# EAGLE design LEDs - Schematic (EAGLE 6.5.0)
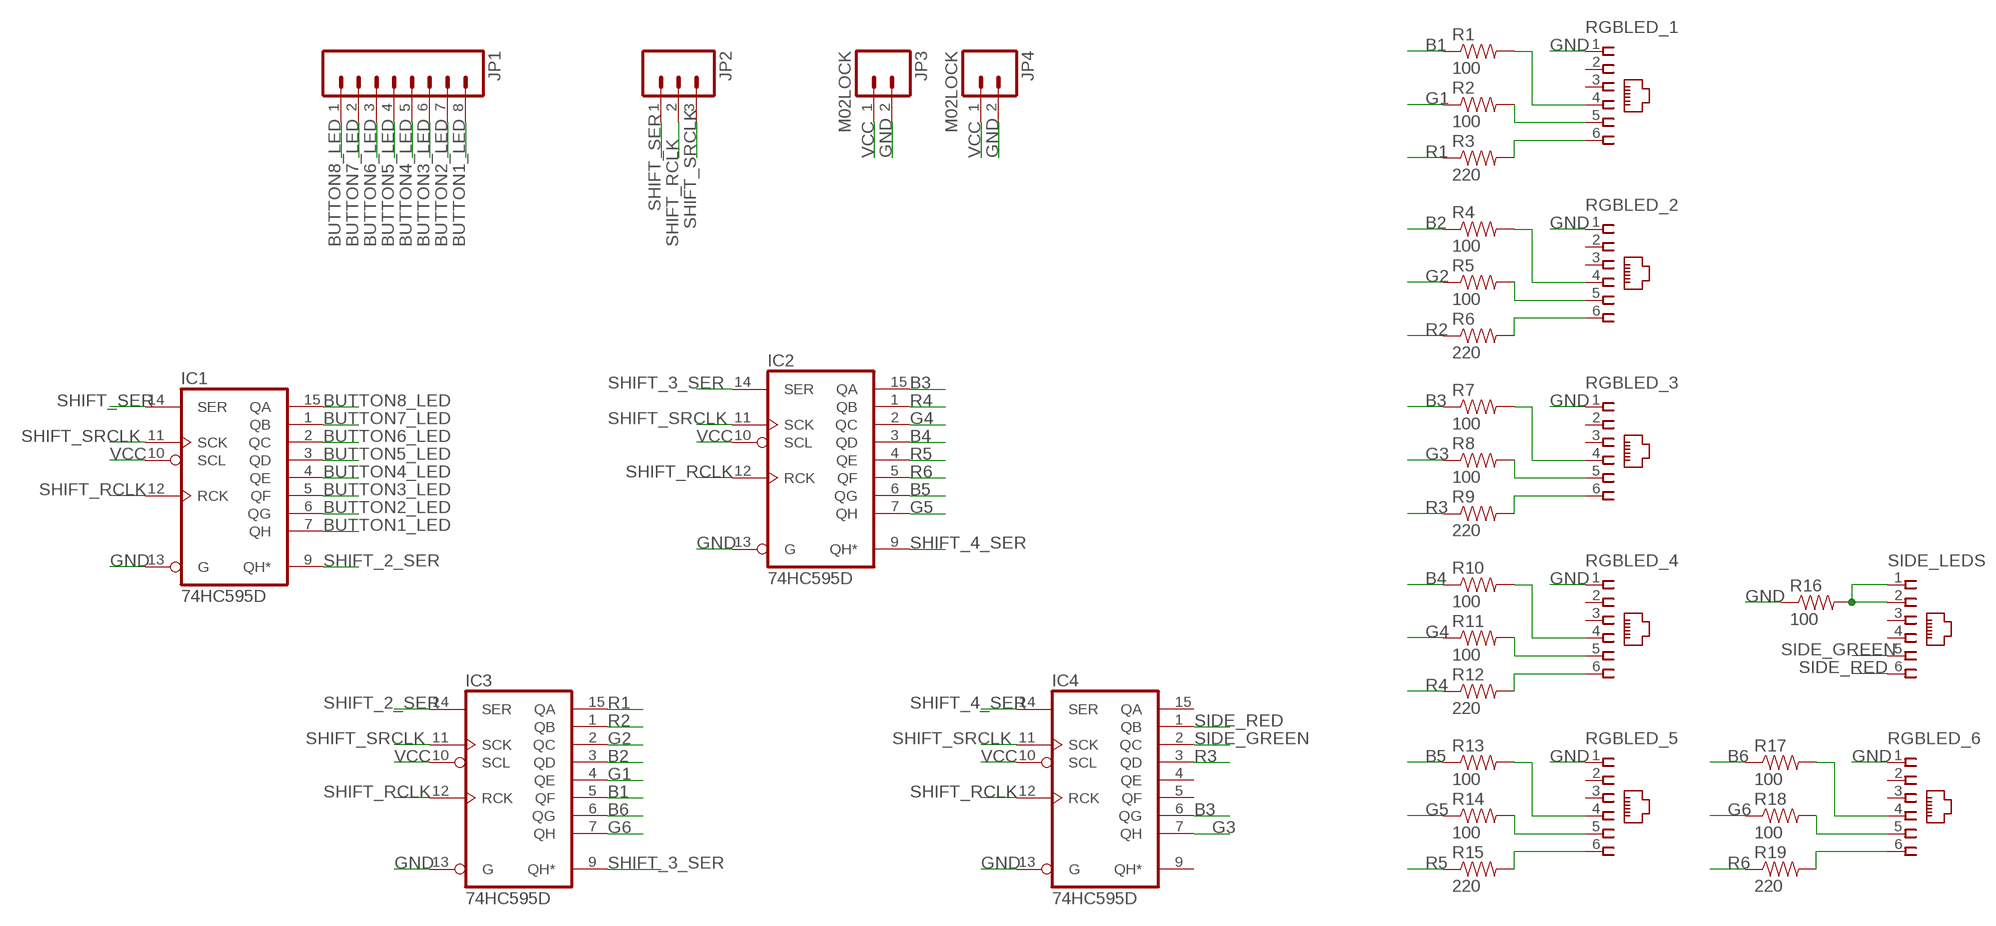
[diagram p0: schematic, sheet 1]

## Parts
IC1  74HC595D  [SO16]
IC2  74HC595D  [SO16]
IC3  74HC595D  [SO16]
IC4  74HC595D  [SO16]
JP1  M08LOCK  [1X08_LOCK]
JP2  M03LOCK  [1X03_LOCK]
JP3  M02LOCK  [1X02_LOCK]
JP4  M02LOCK  [1X02_LOCK]
R1  100  RESISTOR0603  [0603-RES]
R2  100  RESISTOR0603  [0603-RES]
R3  220  RESISTOR0603  [0603-RES]
R4  100  RESISTOR0603  [0603-RES]
R5  100  RESISTOR0603  [0603-RES]
R6  220  RESISTOR0603  [0603-RES]
R7  100  RESISTOR0603  [0603-RES]
R8  100  RESISTOR0603  [0603-RES]
R9  220  RESISTOR0603  [0603-RES]
R10  100  RESISTOR0603  [0603-RES]
R11  100  RESISTOR0603  [0603-RES]
R12  220  RESISTOR0603  [0603-RES]
R13  100  RESISTOR0603  [0603-RES]
R14  100  RESISTOR0603  [0603-RES]
R15  220  RESISTOR0603  [0603-RES]
R16  100  RESISTOR0603  [0603-RES]
R17  100  RESISTOR0603  [0603-RES]
R18  100  RESISTOR0603  [0603-RES]
R19  220  RESISTOR0603  [0603-RES]
RGBLED_1  555165-1  [555165-1]
RGBLED_2  555165-1  [555165-1]
RGBLED_3  555165-1  [555165-1]
RGBLED_4  555165-1  [555165-1]
RGBLED_5  555165-1  [555165-1]
RGBLED_6  555165-1  [555165-1]
SIDE_LEDS  555165-1  [555165-1]

## Nets
B1: IC3.5(QF) R1.1
B2: IC3.3(QD) R4.1
B3: IC2.15(QA) IC4.6(QG) R7.1
B4: IC2.3(QD) R10.1
B5: IC2.6(QG) R13.1
B6: IC3.6(QG) R17.1
BUTTON1_LED: IC1.7(QH) JP1.8
BUTTON2_LED: IC1.6(QG) JP1.7
BUTTON3_LED: IC1.5(QF) JP1.6
BUTTON4_LED: IC1.4(QE) JP1.5
BUTTON5_LED: IC1.3(QD) JP1.4
BUTTON6_LED: IC1.2(QC) JP1.3
BUTTON7_LED: IC1.1(QB) JP1.2
BUTTON8_LED: IC1.15(QA) JP1.1
G1: IC3.4(QE) R2.1
G2: IC3.2(QC) R5.1
G3: IC4.7(QH) R8.1
G4: IC2.2(QC) R11.1
G5: IC2.7(QH) R14.1
G6: IC3.7(QH) R18.1
GND: IC1.13(G) IC2.13(G) IC3.13(G) IC4.13(G) JP3.2 JP4.2 R16.1 RGBLED_1.1 RGBLED_2.1 RGBLED_3.1 RGBLED_4.1 RGBLED_5.1 RGBLED_6.1
N$17: R1.2 RGBLED_1.4
N$18: R2.2 RGBLED_1.5
N$19: R3.2 RGBLED_1.6
N$20: R4.2 RGBLED_2.4
N$21: R5.2 RGBLED_2.5
N$22: R6.2 RGBLED_2.6
N$23: R7.2 RGBLED_3.4
N$24: R8.2 RGBLED_3.5
N$25: R9.2 RGBLED_3.6
N$26: R10.2 RGBLED_4.4
N$27: R11.2 RGBLED_4.5
N$28: R12.2 RGBLED_4.6
N$29: R13.2 RGBLED_5.4
N$30: R14.2 RGBLED_5.5
N$31: R15.2 RGBLED_5.6
N$32: R17.2 RGBLED_6.4
N$33: R18.2 RGBLED_6.5
N$34: R19.2 RGBLED_6.6
N$35: R16.2 SIDE_LEDS.1 SIDE_LEDS.2
R1: IC3.15(QA) R3.1
R2: IC3.1(QB) R6.1
R3: IC4.3(QD) R9.1
R4: IC2.1(QB) R12.1
R5: IC2.4(QE) R15.1
R6: IC2.5(QF) R19.1
SHIFT_2_SER: IC1.9(QH*) IC3.14(SER)
SHIFT_3_SER: IC2.14(SER) IC3.9(QH*)
SHIFT_4_SER: IC2.9(QH*) IC4.14(SER)
SHIFT_RCLK: IC1.12(RCK) IC2.12(RCK) IC3.12(RCK) IC4.12(RCK) JP2.2
SHIFT_SER: IC1.14(SER) JP2.1
SHIFT_SRCLK: IC1.11(SCK) IC2.11(SCK) IC3.11(SCK) IC4.11(SCK) JP2.3
SIDE_GREEN: IC4.2(QC) SIDE_LEDS.5
SIDE_RED: IC4.1(QB) SIDE_LEDS.6
VCC: IC1.10(SCL) IC2.10(SCL) IC3.10(SCL) IC4.10(SCL) JP3.1 JP4.1
Unconnected: IC4.4(QE) IC4.5(QF) IC4.9(QH*) IC4.15(QA) RGBLED_1.2 RGBLED_1.3 RGBLED_2.2 RGBLED_2.3 RGBLED_3.2 RGBLED_3.3 RGBLED_4.2 RGBLED_4.3 RGBLED_5.2 RGBLED_5.3 RGBLED_6.2 RGBLED_6.3 SIDE_LEDS.3 SIDE_LEDS.4

## Power pins joined to a net without a drawn wire
GND: IC1.8(GND) IC2.8(GND) IC3.8(GND) IC4.8(GND)
VCC: IC1.16(VCC) IC2.16(VCC) IC3.16(VCC) IC4.16(VCC)

## Library data of the parts
IC1-IC4 = 74xx-eu:74*595: 8-bit SHIFT REGISTER, output latch
JP1 = SparkFun-Connectors:M08: Header 8 Standard 8-pin 0.1" header. Use with straight break away headers (SKU : PRT-00116), right angle break away headers (PRT-00553), swiss pins (PRT-00743), machine pins (PRT-00117), and female headers (PRT-00115).
JP2 = SparkFun-Connectors:M03: Header 3 Standard 3-pin 0.1" header. Use with straight break away headers (SKU : PRT-00116), right angle break away headers (PRT-00553), swiss pins (PRT-00743), machine pins (PRT-00117), and female headers (PRT-00115). Molex polarized connector foot print use with SKU : PRT-08232 with associated crimp pins and housings.
JP3 JP4 = SparkFun-Connectors:M02: Standard 2-pin 0.1" header. Use with - straight break away headers ( PRT-00116) - right angle break away headers (PRT-00553) - swiss pins (PRT-00743) - machine pins (PRT-00117) - female headers (PRT-00115) Molex polarized connector foot print use with: PRT-08233 with associated crimp pins and housings. 2.54_SCREWTERM for use with PRT-10571. 3.5mm Screw Terminal footprints for PRT-08084 5mm Screw Terminal footprints for use with PRT-08433
R1-R19 = SparkFun-Resistors:RESISTOR: Resistor Basic schematic elements and footprints for 0603, 1206, and PTH resistors.
RGBLED_1-RGBLED_6 SIDE_LEDS = con-amp:555165-1: AMP connector

## Board
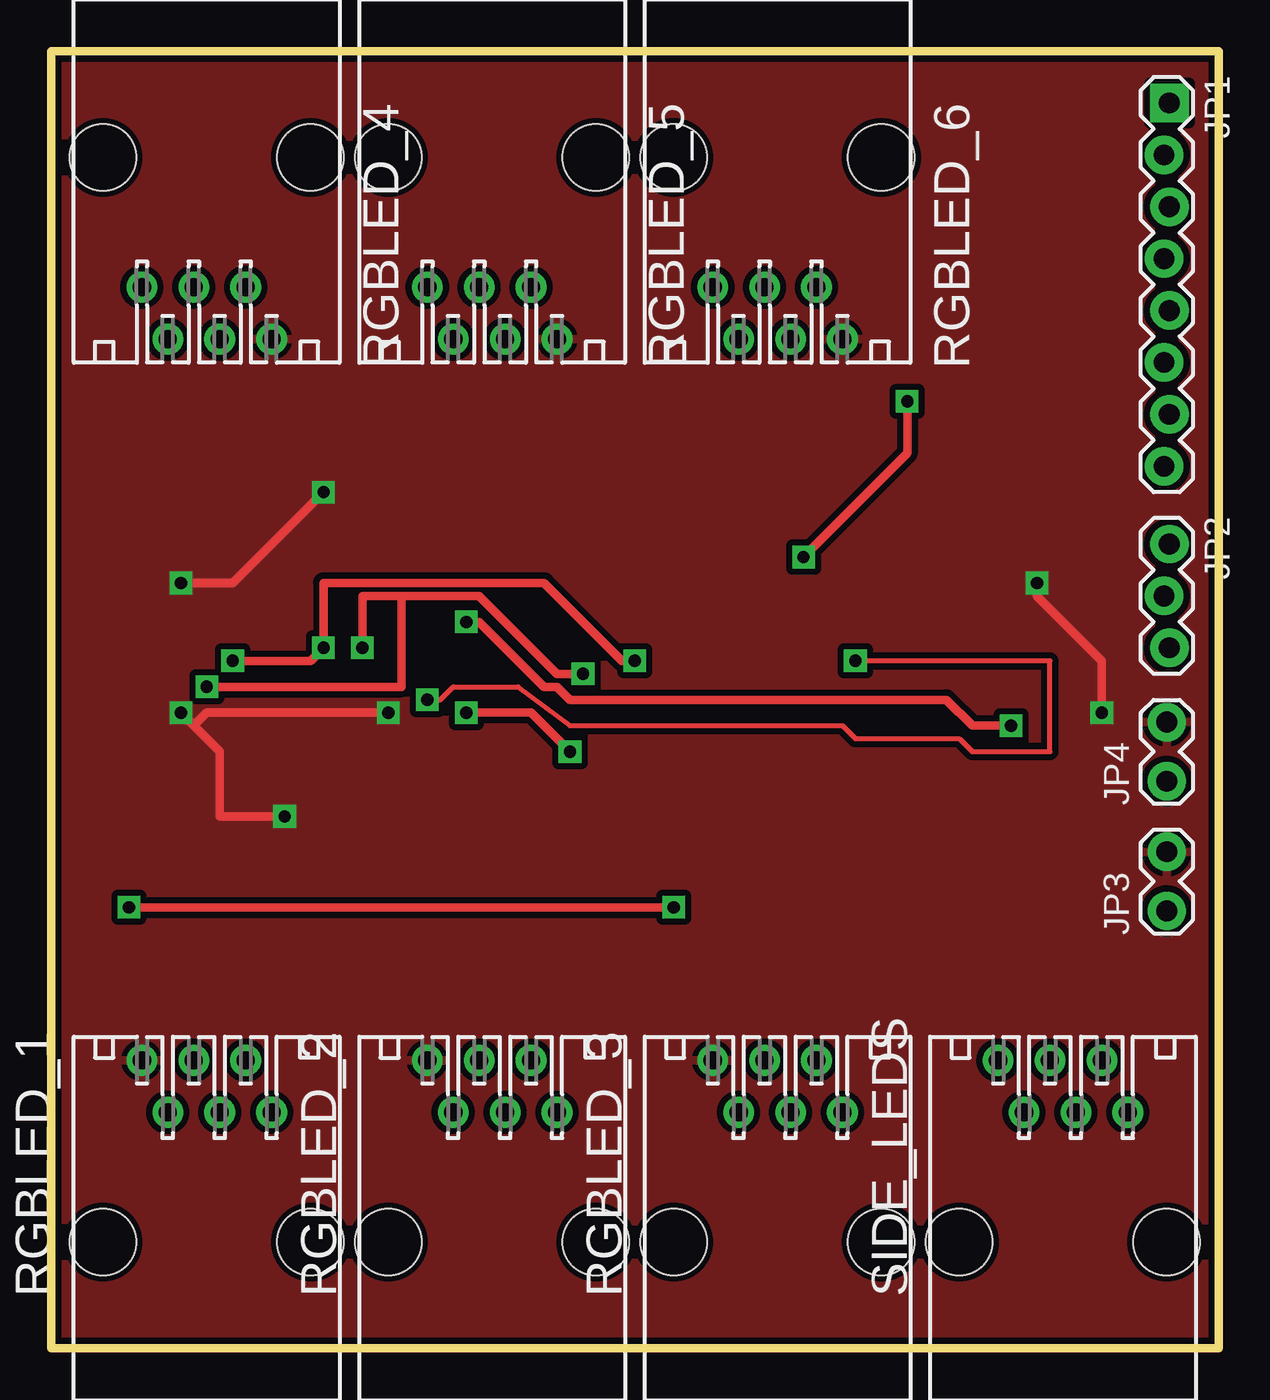
[diagram p1: board, top side]
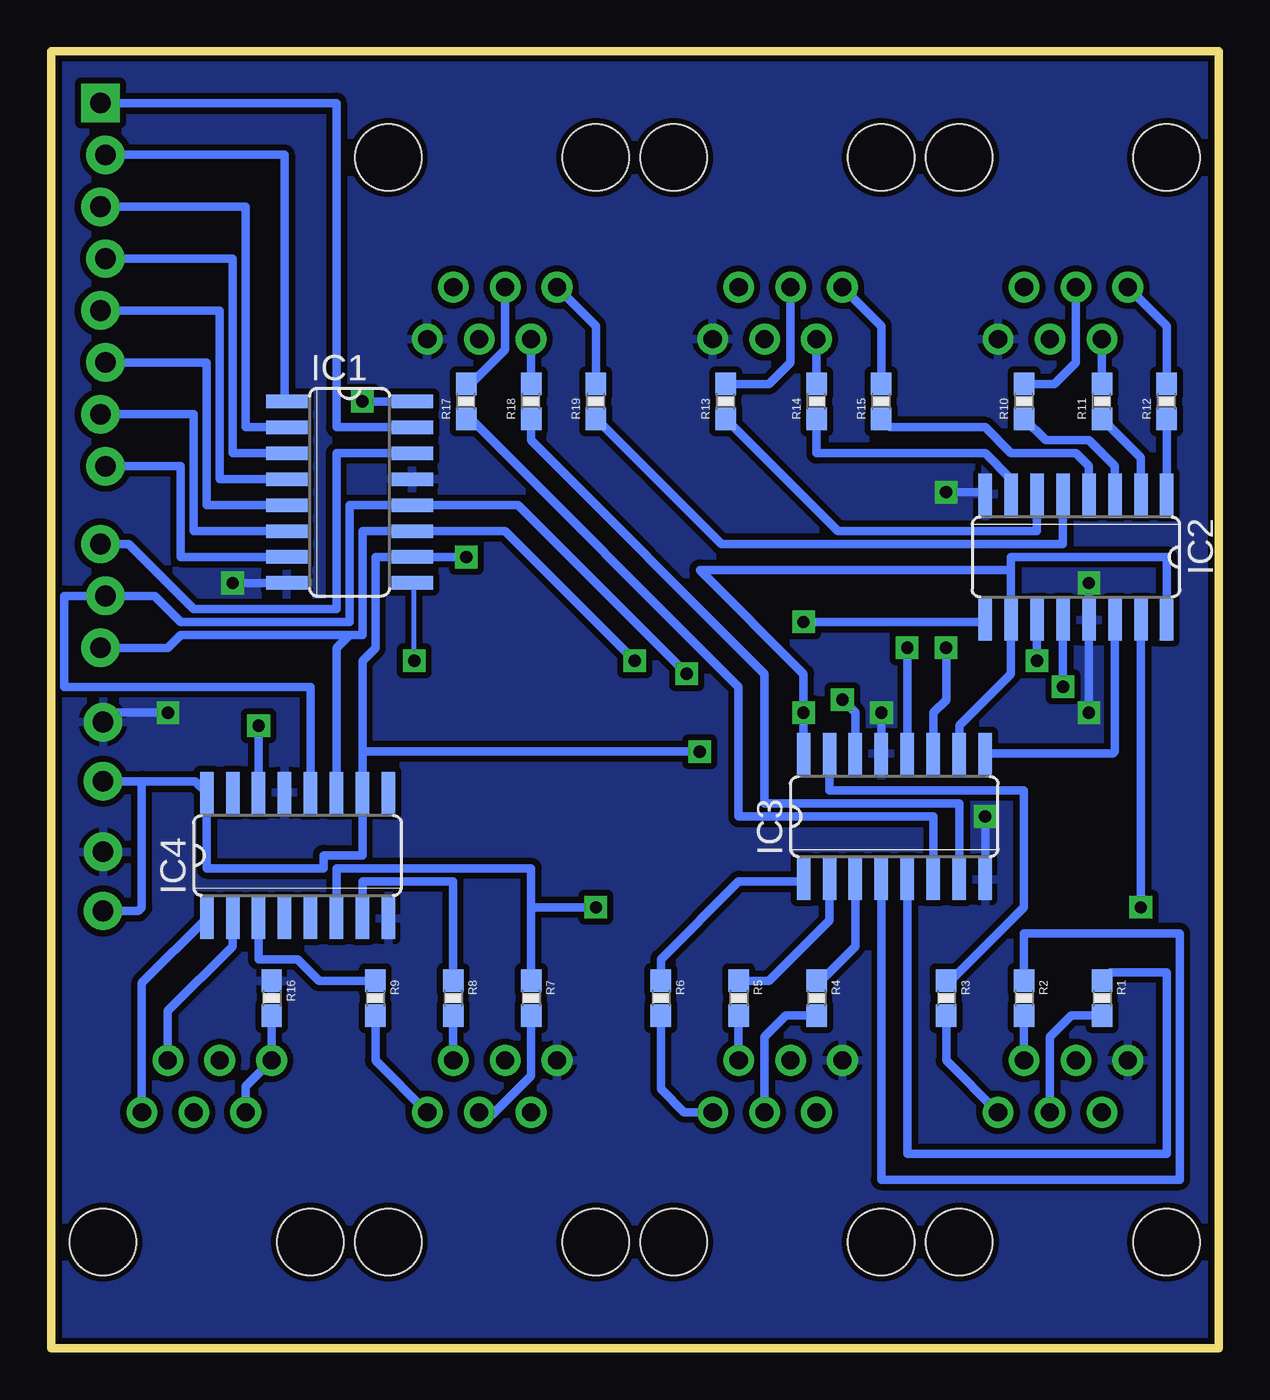
[diagram p2: board, bottom side, seen from below]

Size 57.15 x 63.5 mm. Coordinates in mm from the lower left corner, seen from the top.
Outline: 0,0 0,63.5 57.15,63.5 57.15,0 0,0
Copper layers (1*16): Top 0.035mm / dielectric 1.5mm / Bottom 0.035mm
Design rules "SparkFun": minimum track width 8mil, minimum drill 20mil, track to track 8mil, track to pad 8mil, pad to pad 8mil, via to via 8mil, smd to smd 8mil, copper to edge 8mil, drill to drill 8mil, minimum pad ring 12mil, minimum via ring 10mil, stop-mask expansion 4mil, vias tented up to drill 20mil, thermal gap 10mil

### Footprints (pad centres in the part's own frame; a part is rotated, then mirrored left to right if it is on the bottom)
SO16 = smd 0.66 x 2.032: 1 -4.445,-3.073; 2 -3.175,-3.073; 3 -1.905,-3.073; 4 -0.635,-3.073; 5 0.635,-3.073; 6 1.905,-3.073; 7 3.175,-3.073; 8 4.445,-3.073; 9 4.445,3.073; 10 3.175,3.073; 11 1.905,3.073; 12 0.635,3.073; 13 -0.635,3.073; 14 -1.905,3.073; 15 -3.175,3.073; 16 -4.445,3.073
1X08_LOCK = drill 1.016 pad 1.88 square: 1 0,0.127 | drill 1.016 pad 1.88: 2 2.54,-0.127; 3 5.08,0.127; 4 7.62,-0.127; 5 10.16,0.127; 6 12.7,-0.127; 7 15.24,0.127; 8 17.78,-0.127
1X03_LOCK = drill 1.016 pad 1.88: 1 0,0.127; 2 2.54,-0.127; 3 5.08,0.127
1X02_LOCK = drill 1.016 pad 1.88: 1 -0.178,0; 2 2.718,0
0603-RES = smd 1.1 x 1: 1 -0.85,0; 2 0.85,0
555165-1 = drill 0.889: 1 -3.175,7.747; 2 -1.905,5.207; 3 -0.635,7.747; 4 0.635,5.207; 5 1.905,7.747; 6 3.175,5.207 | hole 3.251: -5.08,-1.143; 5.08,-1.143

### Placement (x,y rotation side)
IC1  42.55,41.91 270 bottom
IC2  6.99,38.73 180 bottom
IC3  15.88,26.04 0 bottom
IC4  45.09,24.13 0 bottom
JP1  54.61,60.96 270 top
JP2  54.61,39.37 270 top
JP3  54.61,21.59 90 top
JP4  54.61,27.94 90 top
R1  5.71,17.14 270 bottom
R2  9.53,17.14 270 bottom
R3  13.34,17.14 270 bottom
R4  19.68,17.14 270 bottom
R5  23.5,17.14 270 bottom
R6  27.3,17.14 270 bottom
R7  33.66,17.14 270 bottom
R8  37.47,17.14 270 bottom
R9  41.27,17.14 270 bottom
R10  9.53,46.35 90 bottom
R11  5.71,46.35 90 bottom
R12  2.54,46.35 90 bottom
R13  24.13,46.35 90 bottom
R14  19.68,46.35 90 bottom
R15  16.51,46.35 90 bottom
R16  46.35,17.14 270 bottom
R17  36.83,46.35 90 bottom
R18  33.66,46.35 90 bottom
R19  30.48,46.35 90 bottom
RGBLED_1  7.62,6.35 0 top
RGBLED_2  21.59,6.35 0 top
RGBLED_3  35.56,6.35 0 top
RGBLED_4  7.62,57.15 180 top
RGBLED_5  21.59,57.15 180 top
RGBLED_6  35.56,57.15 180 top
SIDE_LEDS  49.53,6.35 0 top

### Tracks (layer width: path | path; a pad name or v marks a point on that pad's centre or on a via)
B1
  Bottom 0.406: IC3.5 15.24,9.53 2.54,9.53 2.54,18.41 5.29,18.41 R1.1
B2
  Bottom 0.406: R4.1 19.47,18 17.78,19.68 IC3.3
B3  (via drill 0.6)
  Top 0.406: v3.81,21.59 v30.48,21.59
  Bottom 0.406: R7.1 33.66,21.59 | 33.66,21.59 33.66,23.5 43.18,23.5 IC4.6 | IC2.15 v3.81,21.59 | v30.48,21.59 33.66,21.59
B4
  Bottom 0.406: IC2.3 5.08,43.18 6.35,44.45 8.47,44.45 R10.1
B5
  Bottom 0.406: IC2.6 8.89,40.01 18.63,40.01 R13.1
B6
  Bottom 0.406: R17.1 36.62,45.51 23.5,32.38 23.5,26.04 13.97,26.04 IC3.6
BUTTON1_LED
  Bottom 0.406: JP1.8 50.8,43.18 50.8,38.73 IC1.7
BUTTON2_LED
  Bottom 0.406: JP1.7 50.16,45.72 50.16,40.01 IC1.6
BUTTON3_LED
  Bottom 0.406: JP1.6 49.53,48.26 49.53,41.27 IC1.5
BUTTON4_LED
  Bottom 0.406: JP1.5 48.9,50.8 48.9,42.55 IC1.4
BUTTON5_LED
  Bottom 0.406: JP1.4 48.26,53.34 48.26,43.81 IC1.3
BUTTON6_LED
  Bottom 0.406: JP1.3 47.62,55.88 47.62,45.09 IC1.2
BUTTON7_LED
  Bottom 0.406: JP1.2 45.72,58.42 45.72,46.46 IC1.1
BUTTON8_LED
  Bottom 0.406: JP1.1 43.18,60.96 43.18,45.09 IC1.15
G1
  Bottom 0.406: IC3.4 16.51,8.26 1.91,8.26 1.91,20.32 9.53,20.32 R2.1
G2
  Bottom 0.406: R5.1 22.01,18 19.05,20.95 IC3.2
G3
  Bottom 0.406: R8.1 37.47,22.86 41.91,22.86 IC4.7
G4
  Bottom 0.406: IC2.2 3.81,43.6 R11.1
G5
  Bottom 0.406: IC2.7 10.16,42.55 11.43,43.81 19.68,43.81 R14.1
G6
  Bottom 0.406: R18.1 33.66,44.45 22.23,33.02 22.23,26.67 12.7,26.67 IC3.7
GND  (via drill 0.6)
  Top 0.406: v11.43,26.04 8.26,26.04 8.26,29.21 6.99,30.48 | 6.99,30.48 v6.35,31.11 | v16.51,31.11 7.62,31.11 6.99,30.48 | v6.35,37.47 8.89,37.47 v13.34,41.91 | v48.26,37.47 48.26,36.83 51.44,33.66 v51.44,31.11
  Bottom 0.406: IC3.8 v11.43,26.04 | v6.35,31.11 IC2.13 v6.35,37.47 | IC3.13 v16.51,31.11 | v13.34,41.91 11.53,41.91 IC2.8 | IC1.8 v48.26,37.47 | v51.44,31.11 54.15,31.11 JP4.2
  pour Top (isolate 0.305): 0,0 0,63.5 57.15,63.5 57.15,0
  pour Bottom (isolate 0.305): 0,0 0,63.5 57.15,63.5 57.15,0
N$17
  Bottom 0.406: R1.2 7.2,16.3 8.26,15.24 RGBLED_1.4
N$18
  Bottom 0.406: R2.2 RGBLED_1.5
N$19
  Bottom 0.406: R3.2 13.34,14.1 RGBLED_1.6
N$20
  Bottom 0.406: R4.2 21.17,16.3 22.23,15.24 RGBLED_2.4
N$21
  Bottom 0.406: R5.2 RGBLED_2.5
N$22
  Bottom 0.406: RGBLED_2.6 26.16,11.56 27.3,12.7 R6.2
N$23
  Bottom 0.406: R7.2 33.66,13.34 35.56,11.43 36.07,11.43 RGBLED_3.4
N$24
  Bottom 0.406: R8.2 RGBLED_3.5
N$25
  Bottom 0.406: R9.2 41.27,14.1 RGBLED_3.6
N$26
  Bottom 0.406: R10.2 8.04,47.2 6.99,48.26 RGBLED_4.4
N$27
  Bottom 0.406: R11.2 RGBLED_4.5
N$28
  Bottom 0.406: R12.2 2.54,50.04 RGBLED_4.6
N$29
  Bottom 0.406: R13.2 22.01,47.2 20.95,48.26 RGBLED_5.4
N$30
  Bottom 0.406: R14.2 RGBLED_5.5
N$31
  Bottom 0.406: R15.2 16.51,50.04 RGBLED_5.6
N$32
  Bottom 0.406: R17.2 36.62,47.2 34.92,48.9 RGBLED_6.4
N$33
  Bottom 0.406: R18.2 RGBLED_6.5
N$34
  Bottom 0.406: R19.2 30.48,50.04 RGBLED_6.6
N$35
  Bottom 0.406: SIDE_LEDS.2 47.62,12.83 SIDE_LEDS.1 R16.2
R1
  Bottom 0.406: R3.1 13.12,18 9.53,21.59 9.53,27.3 19.05,27.3 IC3.15
R2
  Bottom 0.406: R6.1 27.3,19.05 23.5,22.86 20.42,22.86 IC3.1
R3
  Bottom 0.406: R9.1 44.03,18 45.09,19.05 46.99,19.05 IC4.3
R4
  Bottom 0.406: IC2.1 R12.1
R5
  Bottom 0.406: IC2.4 6.35,43.18 6.99,43.81 10.16,43.81 11.43,45.09 16.09,45.09 R15.1
R6
  Bottom 0.406: IC2.5 7.62,39.37 24.34,39.37 R19.1
SHIFT_2_SER  (via drill 0.6)
  Top 0.254: v18.41,31.75 19.05,31.75 19.68,32.38 22.86,32.38 25.4,30.48 38.73,30.48 39.37,29.84 44.45,29.84 45.09,29.21 48.9,29.21 48.9,33.66 v39.37,33.66
  Bottom 0.254: v39.37,33.66 39.37,37.36 IC1.9
  Bottom 0.406: IC3.14 17.78,31.11 v18.41,31.75
SHIFT_3_SER
  Bottom 0.406: IC3.9 5.18,29.11 5.08,29.21 IC2.14
SHIFT_4_SER  (via drill 0.6)
  Top 0.406: v20.32,35.56 20.95,35.56 24.13,32.38 24.77,32.38 25.4,31.75 43.81,31.75 45.09,30.48 v46.99,30.48
  Bottom 0.406: IC4.14 v46.99,30.48 | v20.32,35.56 11.53,35.56 IC2.9
SHIFT_RCLK  (via drill 0.6)
  Top 0.406: v26.04,33.02 24.77,33.02 20.95,36.83 17.14,36.83 | 17.14,36.83 15.24,36.83 v15.24,34.29 | v7.62,32.38 17.14,32.38 17.14,36.83
  Bottom 0.406: IC4.12 44.45,32.38 56.52,32.38 56.52,36.83 JP2.2 52.07,36.83 50.8,35.56 42.55,35.56 42.55,41.27 IC1.12 34.29,41.27 v26.04,33.02 | v15.24,34.29 IC3.12 | IC2.12 v7.62,32.38
SHIFT_SER
  Bottom 0.406: JP2.1 53.34,39.37 50.16,36.2 43.18,36.2 43.18,43.81 IC1.14
SHIFT_SRCLK  (via drill 0.6)
  Top 0.406: v28.57,33.66 27.94,33.66 24.13,37.47 13.34,37.47 v13.34,34.29 12.7,33.66 v8.89,33.66
  Bottom 0.406: JP2.3 51.44,34.29 50.8,34.92 42.55,34.92 | 42.55,34.92 41.91,34.92 41.91,40.01 IC1.11 34.92,40.01 v28.57,33.66 | IC4.11 43.18,34.29 42.55,34.92 | v13.34,34.29 13.34,31.75 13.97,31.11 IC3.11 | IC2.11 v8.89,33.66
SIDE_GREEN
  Bottom 0.406: IC4.2 48.26,19.68 51.44,16.51 SIDE_LEDS.5
SIDE_RED
  Bottom 0.406: SIDE_LEDS.6 52.7,17.88 IC4.1
VCC  (via drill 0.6)
  Top 0.406: v20.32,31.11 23.5,31.11 v25.4,29.21 | v41.91,46.35 41.91,43.81 v36.83,38.73
  Bottom 0.406: JP4.1 52.7,27.76 | 52.7,27.76 50.09,27.76 IC4.16 49.53,23.5 43.81,23.5 43.81,24.13 41.91,24.13 IC4.10 41.91,29.21 | JP3.1 52.88,21.41 52.7,21.59 52.7,27.76 | 41.91,29.21 41.91,33.66 41.27,34.29 41.27,38.73 IC1.10 v36.83,38.73 | IC3.10 12.7,30.48 10.16,33.02 IC2.10 10.16,38.1 | IC2.16 2.54,38.73 10.16,38.73 10.16,38.1 | v20.32,31.11 IC3.16 20.32,33.02 25.4,38.1 10.16,38.1 | v25.4,29.21 41.91,29.21 | IC1.16 v41.91,46.35